# EAGLE design hxb-adapter (EAGLE 5.11)
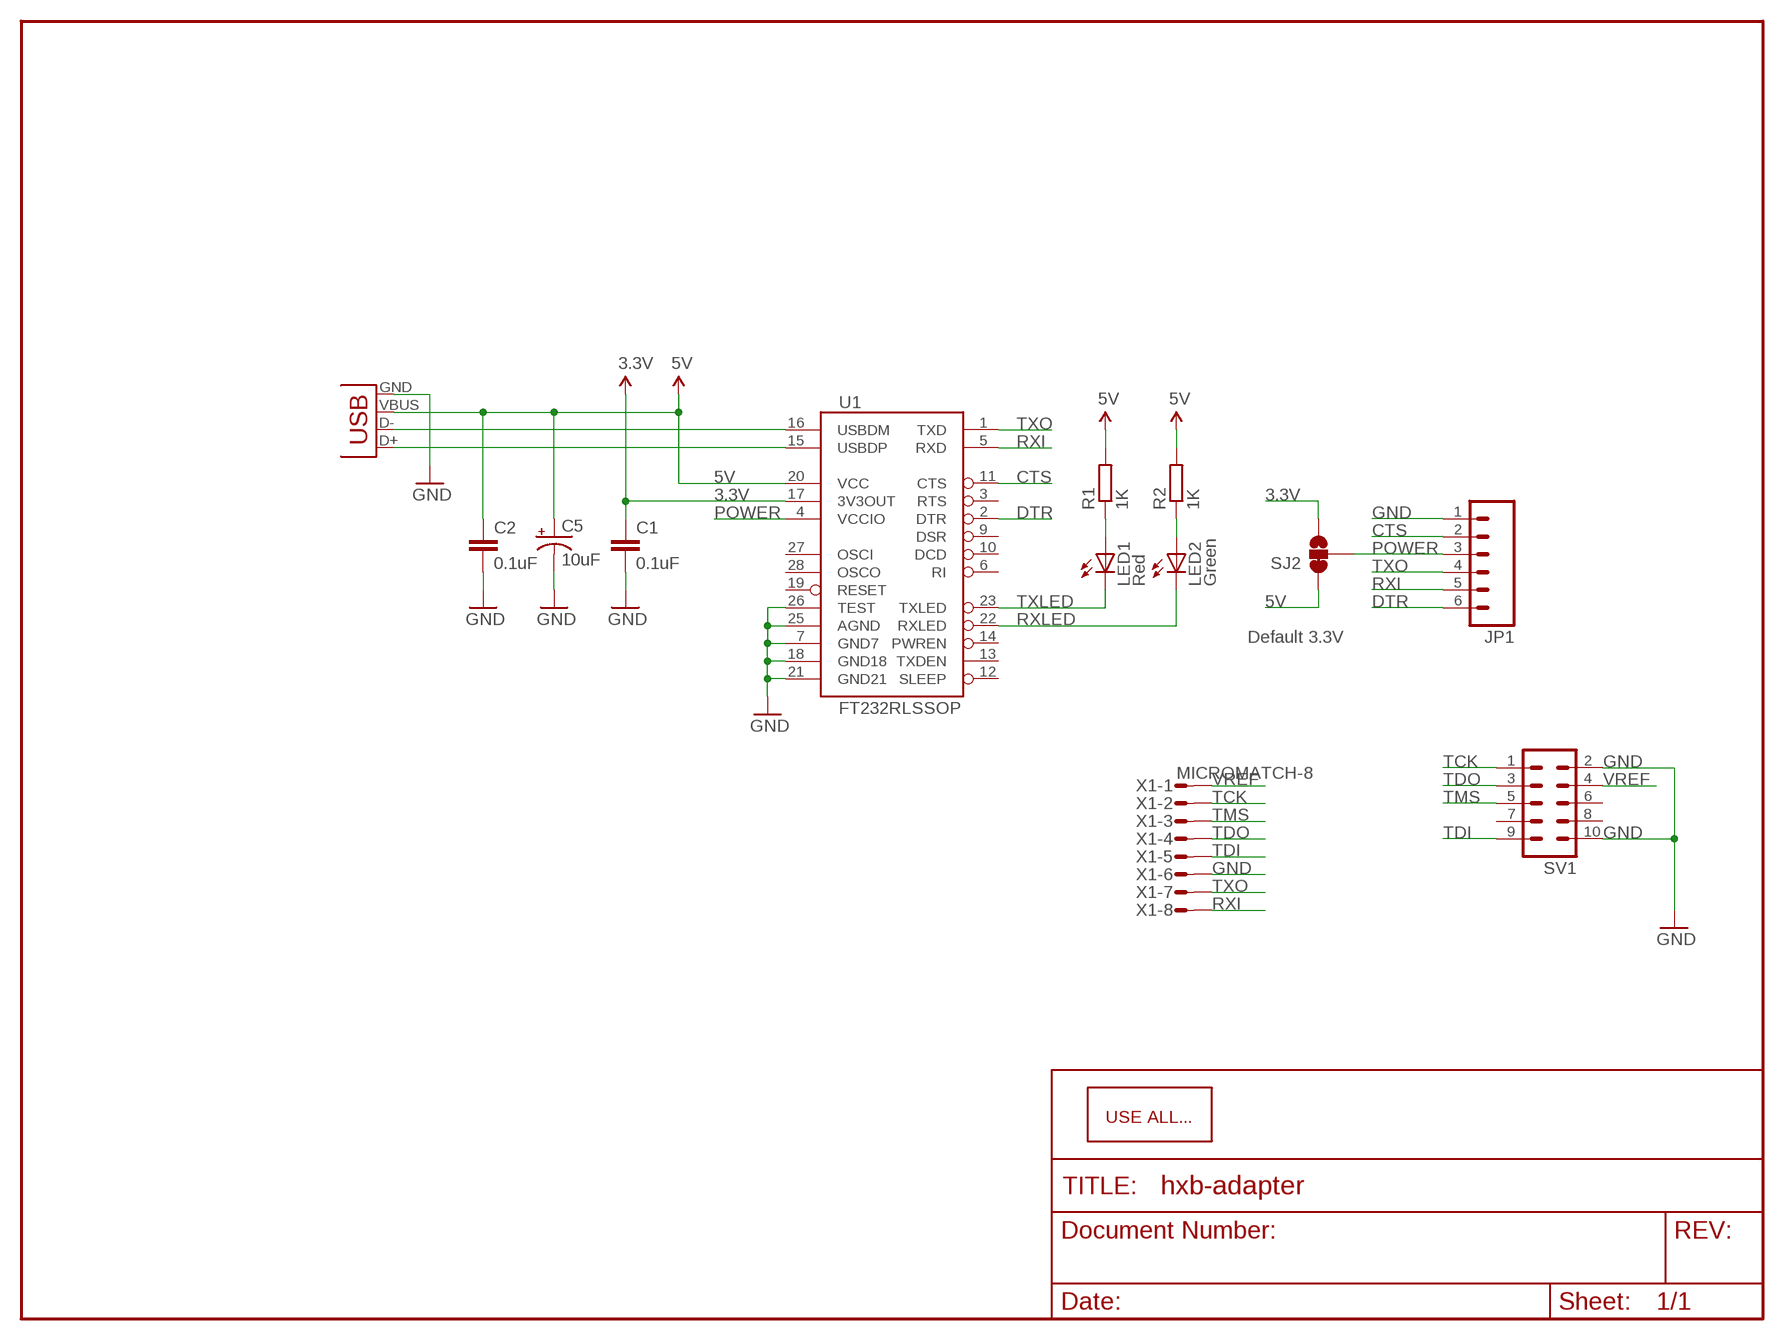
[diagram p0: schematic, sheet 1]

## Parts
C1  0.1uF  C-EUC1206  [C1206]
C2  0.1uF  C-EUC1206  [C1206]
C5  10uF  CAP_POL1206  [EIA3216]
JP1  M06SMD-FEMALE-V2  [1X06-SMD-FEMALE-V2]
LED1  Red  LEDCHIPLED_1206  [CHIPLED_1206]
LED2  Green  LEDCHIPLED_1206  [CHIPLED_1206]
R1  1K  R-EU_M1206  [M1206]
R2  1K  R-EU_M1206  [M1206]
SJ2  SOLDERJUMPER_2WAYS  [SJ_3]
SV1  ML10  [ML10]
U1  FT232RLSSOP  [SSOP28DB]
U$2  USE-ALL  [USE-ALL]
X1  MICROMATCH-8  [MICROMATCH-8]
X2  USB-SMD-NS  [USB-MINIB-NOSTOP]

## Nets
3.3V [power]: C1.1 SJ2.3 U1.17(3V3OUT)
5V: C2.1 C5.A(+) R1.2 R2.2 SJ2.1 U1.20(VCC) X2.VBUS
CTS: JP1.2 U1.11(CTS)
DTR: JP1.6 U1.2(DTR)
GND [power]: C1.2 C2.2 C5.C(-) JP1.1 SV1.2 SV1.10 U1.7(GND7) U1.18(GND18) U1.21(GND21) U1.25(AGND) U1.26(TEST) X1.6 X2.GND
N$1: LED1.A R1.1
N$2: LED2.A R2.1
POWER: JP1.3 SJ2.2 U1.4(VCCIO)
RXI: JP1.5 U1.5(RXD) X1.8
RXLED: LED2.C U1.22(RXLED)
TCK: SV1.1 X1.2
TDI: SV1.9 X1.5
TDO: SV1.3 X1.4
TMS: SV1.5 X1.3
TXLED: LED1.C U1.23(TXLED)
TXO: JP1.4 U1.1(TXD) X1.7
USB_D+: U1.15(USBDP) X2.D+
USB_D-: U1.16(USBDM) X2.D-
VREF: SV1.4 X1.1
Unconnected: SV1.6 SV1.7 SV1.8 U1.3(RTS) U1.6(RI) U1.9(DSR) U1.10(DCD) U1.12(SLEEP) U1.13(TXDEN) U1.14(PWREN) U1.19(RESET) U1.27(OSCI) U1.28(OSCO)

## Notes on the sheet
- Default 3.3V

## Library data of the parts
C1 C2 = rcl:C-EU: CAPACITOR, European symbol
C5 = SparkFun:CAP_POL: Capacitor Polarized These are standard SMD and PTH capacitors. Normally 10uF, 47uF, and 100uF in electrolytic and tantalum varieties. Always verify the external diameter of the through hole cap, it varies with capacity, voltage, and manufacturer. The EIA devices should be standard.
JP1 = SparkFun:M06: Header 6 Standard 6-pin 0.1" header. Use with straight break away headers (SKU : PRT-00116), right angle break away headers (PRT-00553), swiss pins (PRT-00743), machine pins (PRT-00117), and female headers (PRT-00115). Molex polarized connector foot print use with SKU : PRT-08094 with associated crimp pins and housings. NOTES ON THE VARIANTS LOCK and LOCK_LONGPADS... This footprint was designed to help hold the alignment of a through-hole component (i.e. 6-pin header) while soldering it into place. You may notice that each hole has been shifted either up or down by 0.005 of an inch from it's more standard position (which is a perfectly straight line). This slight alteration caused the pins (the squares in the middle) to touch the edges of the holes. Because they are alternating, it causes a "brace" to hold the component in place. 0.005 has proven to be the perfect amount of "off-center" position when using our standard breakaway headers. Although looks a little odd when you look at the bare footprint, once you have a header in there, the alteration is very hard to notice. Also, if you push a header all the way into place, it is covered up entirely on the bottom side. This idea of altering the position of holes to aid alignment will be further integrated into the Sparkfun Library for other footprints. It can help hold any component with 3 or more connection pins.
LED1 LED2 = led:LED: LED OSRAM: - CHIPLED LG R971, LG N971, LY N971, LG Q971, LY Q971, LO R971, LY R971 LH N974, LH R974 LS Q976, LO Q976, LY Q976 LO Q996 - Hyper CHIPLED LW Q18S LB Q993, LB Q99A, LB R99A - SideLED LS A670, LO A670, LY A670, LG A670, LP A670 LB A673, LV A673, LT A673, LW A673 LH A674 LY A675 LS A676, LA A676, LO A676, LY A676, LW A676 LS A679, LY A679, LG A679 - Hyper Micro SIDELED® LS Y876, LA Y876, LO Y876, LY Y876 LT Y87S - SmartLED LW L88C, LW L88S LB L89C, LB L89S, LG L890 LS L89K, LO L89K, LY L89K LS L896, LA L896, LO L896, LY L896 - TOPLED LS T670, LO T670, LY T670, LG T670, LP T670 LSG T670, LSP T670, LSY T670, LOP T670, LYG T670 LG T671, LOG T671, LSG T671 LB T673, LV T673, LT T673, LW T673 LH T674 LS T676, LA T676, LO T676, LY T676, LB T676, LH T676, LSB T676, LW T676 LB T67C, LV T67C, LT T67C, LS T67K, LO T67K, LY T67K, LW E67C LS E67B, LA E67B, LO E67B, LY E67B, LB E67C, LV E67C, LT E67C LW T67C LS T679, LY T679, LG T679 LS T770, LO T770, LY T770, LG T770, LP T770 LB T773, LV T773, LT T773, LW T773 LH T774 LS E675, LA E675, LY E675, LS T675 LS T776, LA T776, LO T776, LY T776, LB T776 LHGB T686 LT T68C, LB T68C - Hyper Mini TOPLED® LB M676 - Mini TOPLED Santana® LG M470 LS M47K, LO M47K, LY M47K Source: http://www.osram.convergy.de LUXEON: - LUMILED® LXK2-PW12-R00, LXK2-PW12-S00, LXK2-PW14-U00, LXK2-PW14-V00 LXK2-PM12-R00, LXK2-PM12-S00, LXK2-PM14-U00 LXK2-PE12-Q00, LXK2-PE12-R00, LXK2-PE12-S00, LXK2-PE14-T00, LXK2-PE14-U00 LXK2-PB12-K00, LXK2-PB12-L00, LXK2-PB12-M00, LXK2-PB14-N00, LXK2-PB14-P00, LXK2-PB14-Q00 LXK2-PR12-L00, LXK2-PR12-M00, LXK2-PR14-Q00, LXK2-PR14-R00 LXK2-PD12-Q00, LXK2-PD12-R00, LXK2-PD12-S00 LXK2-PH12-R00, LXK2-PH12-S00 LXK2-PL12-P00, LXK2-PL12-Q00, LXK2-PL12-R00 Source: www.luxeon.com KINGBRIGHT: KA-3528ASYC Source: www.kingbright.com
R1 R2 = rcl:R-EU_: RESISTOR, European symbol
SJ2 = SparkFun:SOLDERJUMPER_2WAY: Solder Jumper 2 way solder jumper
SV1 = con-harting-ml:ML10: HARTING; OC_FARNELL: unknown; OC_NEWARK: unknown
U1 = SparkFun:FT232RL: USB UART FT232RL 4th Generation USB UART (USB <-> Serial) Controller. Spark Fun Electronics SKU : COM-00650
U$2 = rageface:USE-ALL
X1 = con-amp-micromatch:MICROMATCH-8: MicroMaTch 8 7-215464-8 / 0-215464-8 Drawing Number C-215464 DDEController.pdf; MF: FARNELL; MPN: 7-215464-8; OC_FARNELL: 3784642; OC_NEWARK: 26H0301
X2 = SparkFun:USB: USB Connectors USB-B-PTH is fully proven SKU : PRT-00139 USB-miniB is fully proven SKU : PRT-00587 USB-A-PCB is untested. USB-A-H is throughly reviewed, but untested. Spark Fun Electronics SKU : PRT-00437 USB-B-SMT is throughly reviewed, but untested. Needs silkscreen touching up. USB-A-S has not been used/tested USB-MB-H has not been used/tested

## Net classes
0 default: width 0.203 mm
1 power: width 0.254 mm

## Board
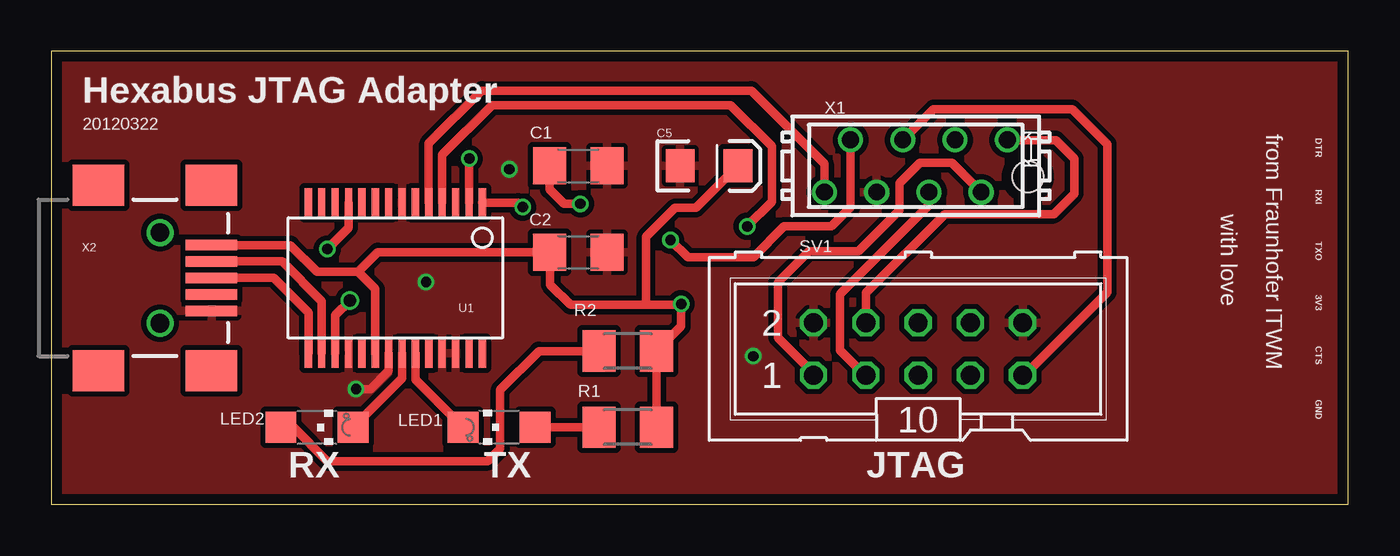
[diagram p1: board, top side]
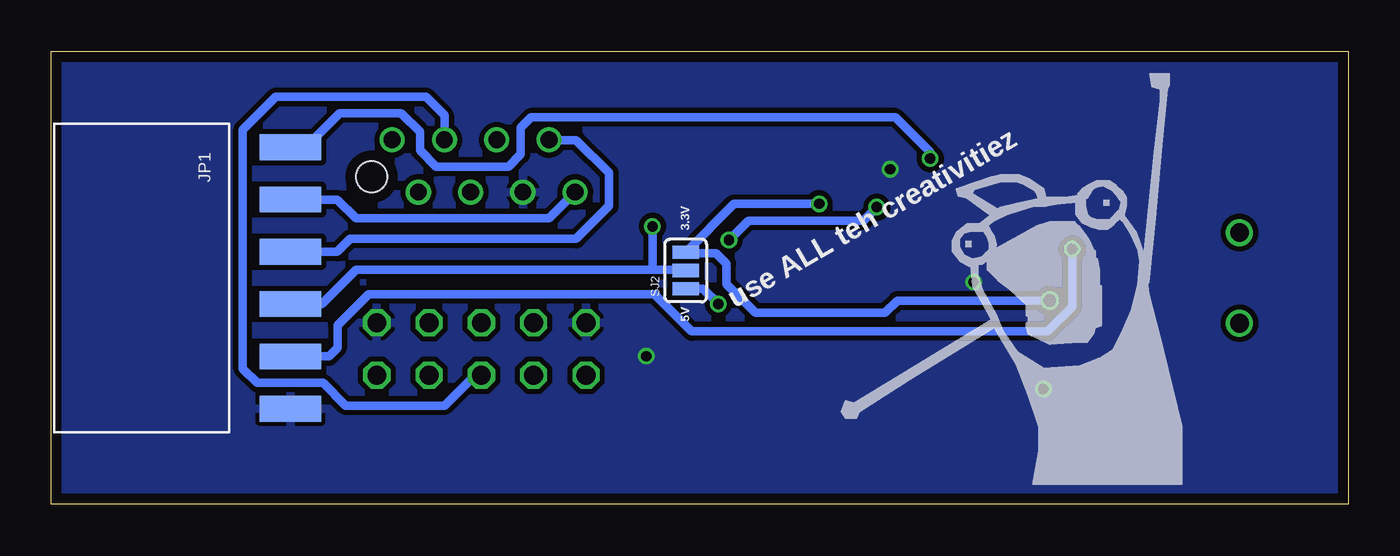
[diagram p2: board, bottom side, seen from below]

Size 63 x 22 mm. Coordinates in mm from the lower left corner, seen from the top.
Outline: 0,0 63,0 63,22 0,22 0,0
Copper layers (1*16): Top 0.035mm / dielectric 1.5mm / Bottom 0.035mm
Design rules "Eagle-DRU - 1109 - LeitOn - 01 and 02 layers": minimum track width 6mil, minimum drill 0.3mm, track to track 6mil, track to pad 6mil, pad to pad 6mil, via to via 6mil, smd to smd 6mil, copper to edge 20mil, drill to drill 10mil, minimum pad ring 8mil, minimum via ring 6mil, stop-mask expansion 3mil, vias tented up to drill 0mil, thermal gap 8mil
Holes 1.5 mm at 47.45,15.91

### Footprints (pad centres in the part's own frame; a part is rotated, then mirrored left to right if it is on the bottom)
C1206 = smd 1.6 x 1.8: 1 -1.4,0; 2 1.4,0
EIA3216 = smd 1.4 x 1.6: A 1.4,0; C -1.4,0
1X06-SMD-FEMALE-V2 = smd 1.25 x 3: 1 6.35,3.425; 2 3.81,3.425; 3 1.27,3.425; 4 -1.27,3.425; 5 -3.81,3.425; 6 -6.35,3.425
CHIPLED_1206 = smd 1.5 x 1.5: A 0,-1.75; C 0,1.75
M1206 = smd 1.6 x 2: 1 -1.4,0; 2 1.4,0
SJ_3 = smd 0.635 x 1.27: 1 -0.889,0; 2 0,0; 3 0.889,0
ML10 = drill 0.914 octagon: 1 -5.08,-1.27; 2 -5.08,1.27; 3 -2.54,-1.27; 4 -2.54,1.27; 5 0,-1.27; 6 0,1.27; 7 2.54,-1.27; 8 2.54,1.27; 9 5.08,-1.27; 10 5.08,1.27
SSOP28DB = smd 0.348 x 1.397: 1 -4.225,-3.656; 2 -3.575,-3.656; 3 -2.925,-3.656; 4 -2.275,-3.656; 5 -1.625,-3.656; 6 -0.975,-3.656; 7 -0.325,-3.656; 8 0.325,-3.656; 9 0.975,-3.656; 10 1.625,-3.656; 11 2.275,-3.656; 12 2.925,-3.656; 13 3.575,-3.656; 14 4.225,-3.656; 15 4.225,3.656; 16 3.575,3.656; 17 2.925,3.656; 18 2.275,3.656; 19 1.625,3.656; 20 0.975,3.656; 21 0.325,3.656; 22 -0.325,3.656; 23 -0.975,3.656; 24 -1.625,3.656; 25 -2.275,3.656; 26 -2.925,3.656; 27 -3.575,3.656; 28 -4.225,3.656
MICROMATCH-8 = drill 0.813: 1 4.445,1.27; 2 3.175,-1.27; 3 1.905,1.27; 4 0.635,-1.27; 5 -0.635,1.27; 6 -1.905,-1.27; 7 -3.175,1.27; 8 -4.445,-1.27
USB-MINIB-NOSTOP = smd 2.5 x 0.5: D+ 2.5,0; D- 2.5,0.8; GND 2.5,-1.6; ID 2.5,-0.8; VBUS 2.5,1.6 | smd 2.5 x 2: G1 -3,-4.5; G2 -3,4.5; G3 2.5,4.5; G4 2.5,-4.5 | drill 0.9 pad 0.8: H1 0,2.2 | drill 0.9 pad 0.787: H2 0,-2.2

### Placement (x,y rotation side)
C1  25.6,16.44 0 top
C2  25.6,12.25 0 top
C5  31.95,16.44 0 top
JP1  54.81,11 270 bottom
LED1  21.75,3.75 90 top
LED2  12.9,3.74 270 top
R1  28,3.75 0 top
R2  28,7.45 0 top
SJ2  32.18,11.36 90 bottom
SV1  42.11,7.55 0 top
U1  16.71,11 180 top
U$2  24.5,1 0 bottom
X1  42,16.44 0 top
X2  5.28,11 0 top

### Tracks (layer width: path | path; a pad name or v marks a point on that pad's centre or on a via)
3.3V  (via drill 0.5, 0.6)
  Top 0.406: U1.17 13.79,9.19 v14.5,9.9 | C1.1 24.2,15.3 24.9,14.6 v25.7,14.6
  Bottom 0.406: v14.5,9.9 21.9,9.9 22.5,9.3 28.8,9.3 30.2,10.7 30.2,11.7 30.7,12.2 32.13,12.2 SJ2.3 29.83,14.6 v25.7,14.6
5V  (via drill 0.5)
  Top 0.406: R1.2 R2.2 30.6,8.65 v30.6,9.74 30.55,9.69 28.89,9.69 | C5.A 31.31,14.4 30.3,14.4 28.89,12.99 28.89,9.69 | X2.VBUS 11.6,12.6 12.9,11.3 14.9,11.3 | U1.20 15.73,10.46 14.9,11.3 | 14.9,11.3 15.85,12.25 C2.1 24.23,12.63 24.23,10.67 25.21,9.69 28.89,9.69
  Bottom 0.406: SJ2.1 31.33,10.47 v30.6,9.74
CTS  (via drill 0.5)
  Top 0.406: U1.11 14.44,13.44 v13.4,12.4
  Bottom 0.406: v13.4,12.4 13.4,9.6 14.6,8.4 31.9,8.4 33.7,10.2 47.6,10.2 49.1,8.7 49.1,7.6 49.51,7.19 JP1.2
DTR  (via drill 0.5)
  Top 0.406: v20.3,16.8 20.3,15.03 U1.2
  Bottom 0.406: v20.3,16.8 20.3,17.1 22,18.8 39.7,18.8 40.2,18.3 40.2,17 40.8,16.4 44.3,16.4 45.1,17.2 45.1,18.1 46,19 49,19 50.65,17.35 JP1.6
GND  (via drill 0.5)
  Top 0.254: C5.C 30.68,16.44
  Top 0.406: U1.21 16.39,6.49 15.5,5.6 v14.8,5.6
  other vias: 18.2,10.8 34.1,7.2 22.25,16.28
  pour Top (isolate 0.254): 0,22 63,22 63,0 0,0
  pour Bottom (isolate 0.254): 0,22 63,22 63,0 0,0
N$1
  Top 0.406: LED1.A R1.1
N$2
  Top 0.406: LED2.A 11.76,3.74 13.4,2.1 21.2,2.1 21.8,2.7 21.8,5.57 23.68,7.45 R2.1
POWER  (via drill 0.5)
  Top 0.406: U1.4 18.98,16.98 21.4,19.4 33,19.4 35,17.4 35,14.7 v33.8,13.5
  Bottom 0.406: 33.8,11.4 48.2,11.4 49.87,9.73 JP1.3 | v33.8,13.5 33.8,11.4 | 33.8,11.4 32.18,11.4 SJ2.2
RXI
  Top 0.406: U1.5 18.34,17.54 20.9,20.1 34.01,20.1 37.55,16.55 X1.8
  Bottom 0.406: JP1.5 49.11,14.81 48.2,13.9 38.83,13.9 X1.8
RXLED
  Top 0.406: U1.22 17.04,6.12 LED2.C
TCK
  Top 0.406: SV1.1 37.03,6.37 35.3,8.1 35.3,10.8 36.8,12.3 39.2,12.3 41.2,14.3 41.2,15.6 42.2,16.6 43.74,16.6 X1.2
TDI
  Top 0.406: SV1.9 47.28,6.28 48.7,7.7 49.1,8.1 51.3,10.3 51.3,17.5 49.6,19.2 42.85,19.2 X1.5
TDO
  Top 0.406: SV1.3 39.52,6.28 38.3,7.5 38.3,10.2 42.63,14.54 X1.4
TMS
  Bottom 0.406: X1.3 43.9,18.9 44.8,19.8 52.1,19.8 53.7,18.2 53.7,6.6 53,5.9 49.8,5.9 48.7,4.8 43.9,4.8 42.42,6.28 SV1.5
TXLED
  Top 0.406: U1.23 17.68,6.07 LED1.C
TXO  (via drill 0.5)
  Top 0.406: X1.7 38.83,14.43 37.9,13.5 35.6,13.5 34.1,12 30.92,12 v30.08,12.84 | v22.9,14.44 22.68,14.66 U1.1
  Bottom 0.406: JP1.4 49.13,12.27 48.5,12.9 37.5,12.9 35.9,14.5 35.9,16.1 37.5,17.7 38.81,17.7 X1.7 | v30.08,12.84 29.13,13.79 23.55,13.79 v22.9,14.44
USB_D+
  Top 0.406: U1.15 12.48,9.31 10.8,11 X2.D+
USB_D-
  Top 0.406: U1.16 13.13,9.87 11.2,11.8 X2.D-
VREF
  Top 0.406: SV1.4 39.57,10.27 43.4,14.1 48.7,14.1 49.7,15.1 49.7,16.8 48.8,17.7 X1.1

### Text on the board
tPlace: Hexabus JTAG Adapter | 20120322 | from Fraunhofer ITWM | DTR | RXI | with love | TXO | 3V3 | CTS | GND | RX | TX | JTAG
bPlace: 3.3V | use ALL teh creativitiez | 5V